# EAGLE design schmittTrigger (EAGLE 9.4.1)
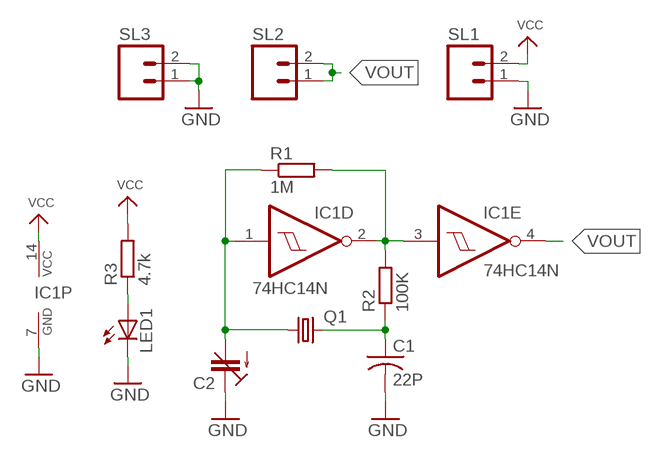
[diagram p0: schematic, sheet 1]

## Parts
C1  22P  C-US025-024X044  [C025-024X044]
C2  C-TRIMM808  [CTRIM808-BC]
IC1  74HC14N  [DIL14]
LED1  LED3MM  [LED3MM]
Q1  CRYSTALTC26H  [TC26H]
R1  1M  R-EU_0204/5  [0204/5]
R2  100K  R-EU_0204/5  [0204/5]
R3  4.7k  R-EU_0204/5  [0204/5]
SL1  M02  [02P]
SL2  M02  [02P]
SL3  M02  [02P]

## Nets
GND: C1.2 C2.1(E) IC1.7(P:GND) LED1.K(C) SL1.1 SL3.1 SL3.2
N$1: C2.2(A) IC1.1(D:I) Q1.1 R1.1
N$2: IC1.2(D:O) IC1.3(E:I) R1.2 R2.2
N$3: C1.1 Q1.2 R2.1
N$4: LED1.A R3.1
VCC: IC1.14(P:VCC) R3.2 SL1.2
VOUT: IC1.4(E:O) SL2.1 SL2.2
Unconnected: IC1.5(F:I) IC1.6(F:O) IC1.8(C:O) IC1.9(C:I) IC1.10(B:O) IC1.11(B:I) IC1.12(A:O) IC1.13(A:I)

## Library data of the parts
C1 = adafruit:C-US: CAPACITOR, American symbol
C2 = rcl:C-TRIMM: Trimm capacitor; SPICEPREFIX: C
IC1 = 74xx-eu:74*14: Hex schmitt trigger INVERTER
LED1 = CEDT_JANUARY_2015_v5:LED
Q1 = adafruit:CRYSTAL: CRYSTAL; OC_FARNELL: unknown; OC_NEWARK: unknown
R1-R3 = rcl:R-EU_: RESISTOR, European symbol; SPICEPREFIX: R
SL1-SL3 = CEDT_JANUARY_2015_v5:M02: AMP QUICK CONNECTOR

## Board
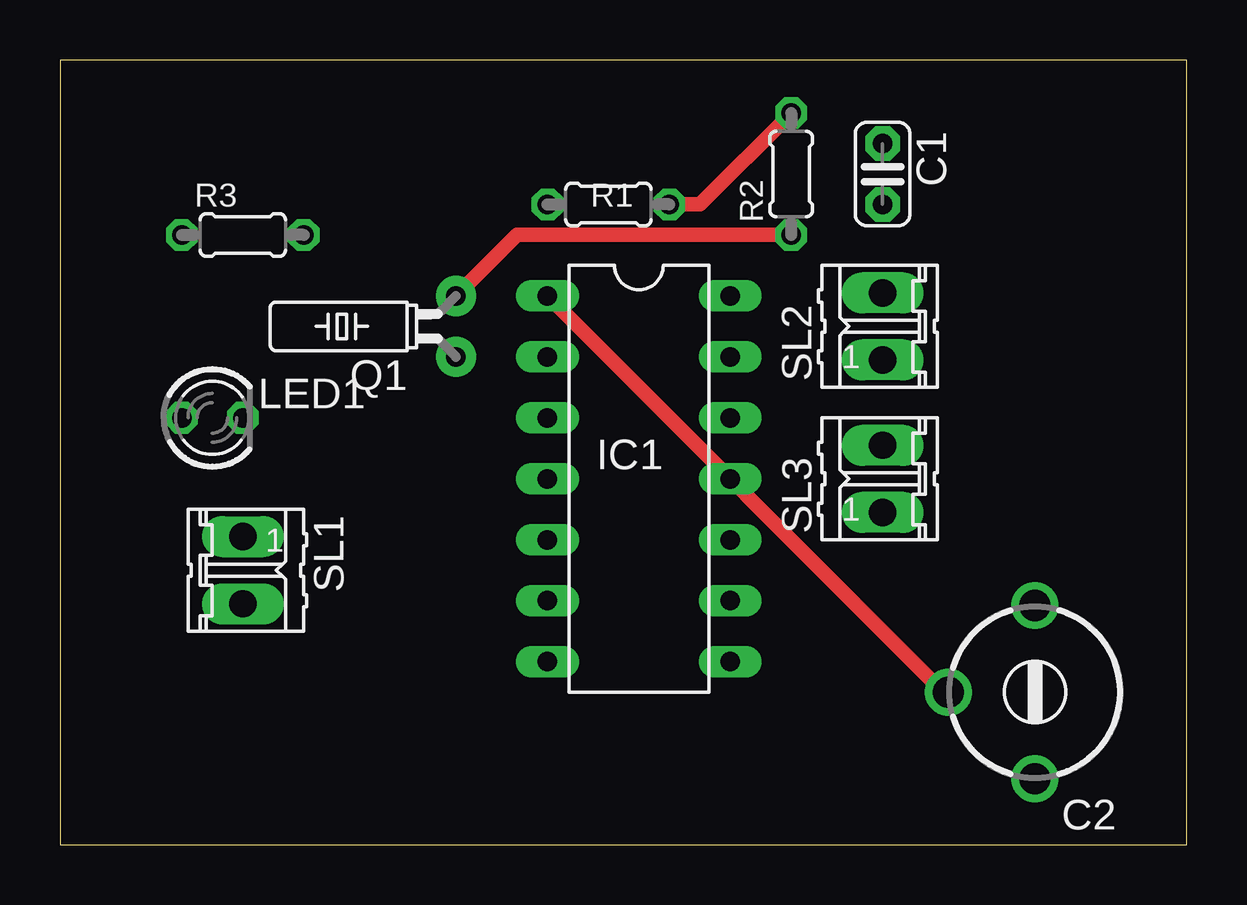
[diagram p1: board, top side]
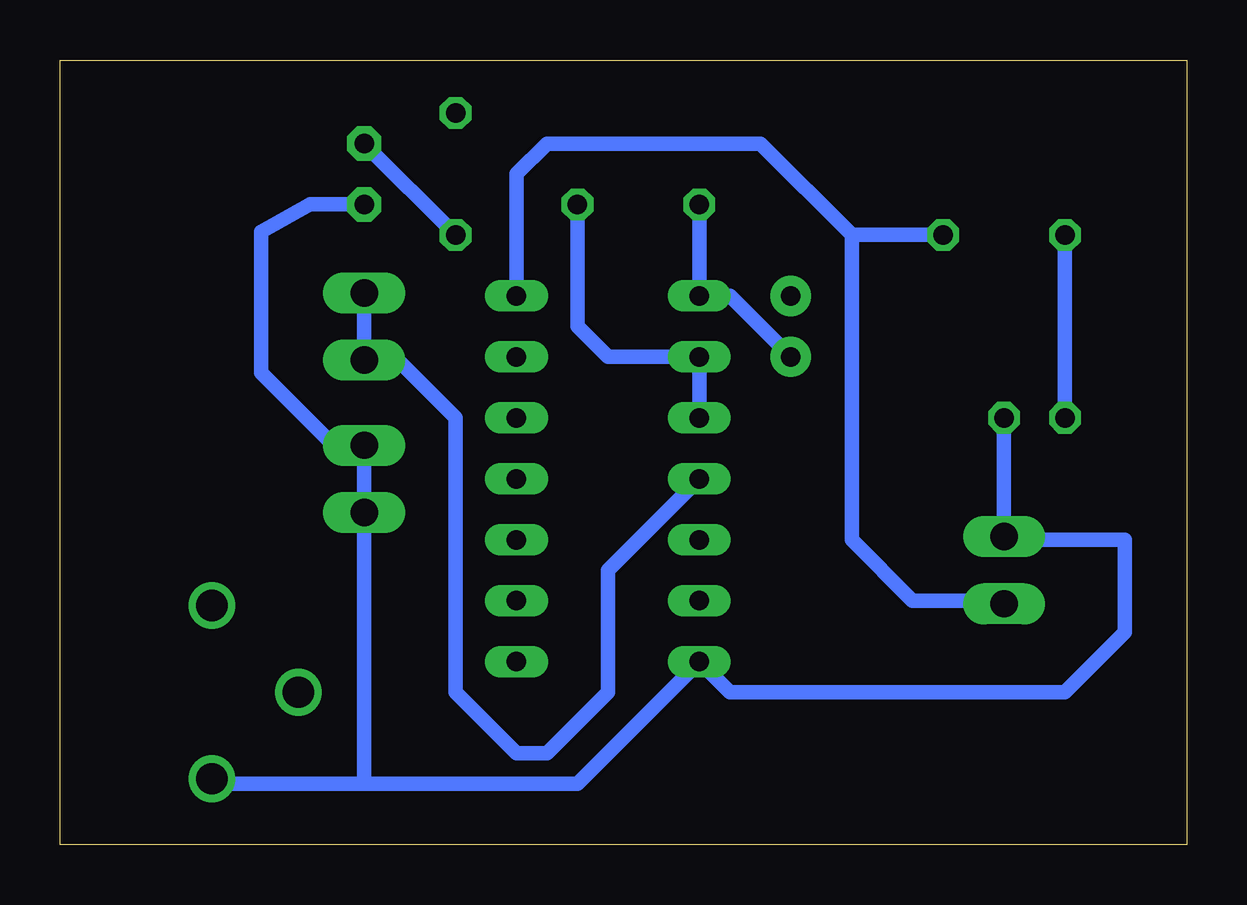
[diagram p2: board, bottom side, seen from below]

Size 46.97 x 32.69 mm. Coordinates in mm from the lower left corner, seen from the top.
Outline: 0,0 46.97,0 46.97,32.69 0,32.69 0,0
Copper layers (1*16): Top 0.035mm / dielectric 1.5mm / Bottom 0.035mm
Design rules "default": minimum track width 6mil, minimum drill 0.35mm, track to track 6mil, track to pad 6mil, pad to pad 6mil, via to via 6mil, smd to smd 6mil, copper to edge 40mil, drill to drill 6mil, minimum pad ring 10mil, minimum via ring 8mil, stop-mask expansion 4mil, vias tented up to drill 0mil, thermal gap 10mil

### Footprints (pad centres in the part's own frame; a part is rotated, then mirrored left to right if it is on the bottom)
C025-024X044 = drill 0.813 pad 1.422 octagon: 1 -1.27,0; 2 1.27,0
CTRIM808-BC = drill 1.3: 1 -3.607,0; 2 0,3.607; 3 3.607,0
DIL14 = drill 0.813 long: 1 -7.62,-3.81; 2 -5.08,-3.81; 3 -2.54,-3.81; 4 0,-3.81; 5 2.54,-3.81; 6 5.08,-3.81; 7 7.62,-3.81; 8 7.62,3.81; 9 5.08,3.81; 10 2.54,3.81; 11 0,3.81; 12 -2.54,3.81; 13 -5.08,3.81; 14 -7.62,3.81
LED3MM = drill 0.813 octagon: A -1.27,0; K 1.27,0
TC26H = drill 0.813 pad 1.676: 1 -1.27,0; 2 1.27,0
0204/5 = drill 0.813 octagon: 1 -2.54,0; 2 2.54,0
02P = drill 1.143 long: 1 -1.397,0; 2 1.397,0

### Placement (x,y rotation side)
C1  34.29,27.94 270 top
C2  40.64,6.35 90 top
IC1  24.13,15.24 270 top
LED1  6.35,17.78 0 top
Q1  16.51,21.59 90 top
R1  22.86,26.67 0 top
R2  30.48,27.94 90 top
R3  7.62,25.4 0 top
SL1  7.62,11.43 270 top
SL2  34.29,21.59 90 top
SL3  34.29,15.24 90 top

### Tracks (layer width: path | path; a pad name or v marks a point on that pad's centre or on a via)
GND
  Bottom 0.61: LED1.K SL1.1 7.49,12.7 2.59,12.7 2.59,8.84 5.08,6.35 19.05,6.35 IC1.7 25.4,2.54 34.29,2.54 | 34.29,2.54 SL3.1 SL3.2 35.56,16.64 38.58,19.66 38.58,25.53 36.54,26.67 C1.2 | 34.29,2.54 40.44,2.54 C2.1
N$1
  Top 0.61: IC1.1 36.83,6.35 C2.2
  Bottom 0.61: R1.1 IC1.1 19.05,22.86 Q1.1
N$2
  Top 0.61: R1.2 26.67,26.67 R2.2
  Bottom 0.61: IC1.3 IC1.2 24.13,20.32 25.4,21.59 R1.2
N$3
  Top 0.61: Q1.2 19.05,25.4 R2.1
  Bottom 0.61: R2.1 C1.1
N$4
  Bottom 0.61: R3.1 LED1.A
VCC
  Bottom 0.61: SL1.2 7.75,10.16 11.43,10.16 13.97,12.7 13.97,25.4 | 13.97,25.4 17.78,29.21 26.67,29.21 27.94,27.94 IC1.14 | R3.2 13.97,25.4
VOUT
  Bottom 0.61: IC1.4 24.13,11.43 24.13,6.35 26.67,3.81 27.94,3.81 30.48,6.35 30.48,17.78 32.89,20.19 SL2.1 SL2.2